# EAGLE design 3-Axis CNC Board v1.1 (EAGLE 6.5.0)
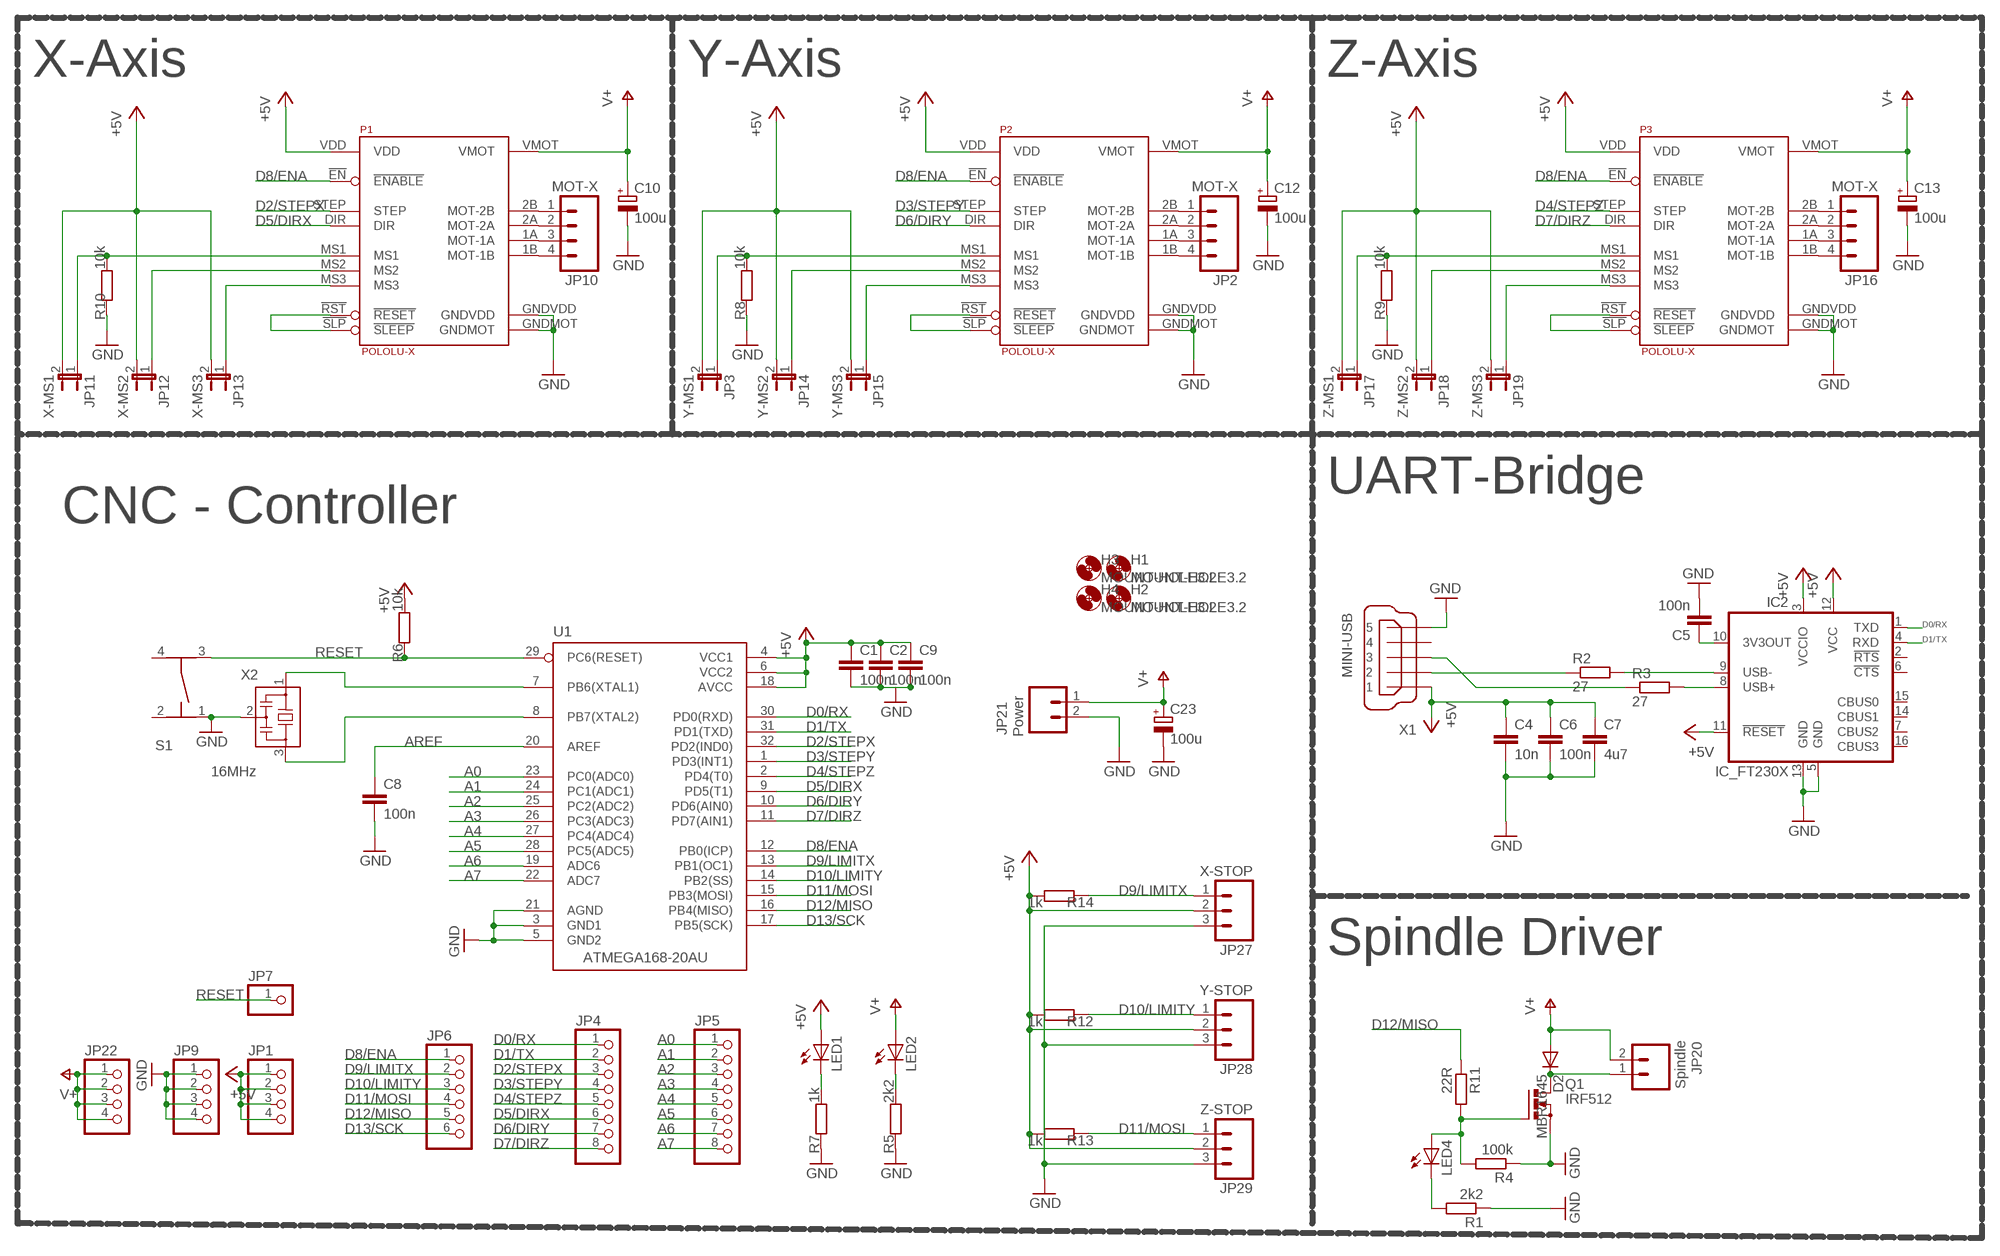
[diagram p0: schematic, sheet 1]

## Parts
C1  100n  C-EUC0805K  [C0805K]
C2  100n  C-EUC0805K  [C0805K]
C4  10n  C-EUC0805K  [C0805K]
C5  100n  C-EUC0805K  [C0805K]
C6  100n  C-EUC0805K  [C0805K]
C7  4u7  C-EUC0805K  [C0805K]
C8  100n  C-EUC0805K  [C0805K]
C9  100n  C-EUC0805K  [C0805K]
C10  100u  CPOL-EUUD-6,3X7,7  [UD-6,3X7,7_NICHICON]
C12  100u  CPOL-EUUD-6,3X7,7  [UD-6,3X7,7_NICHICON]
C13  100u  CPOL-EUUD-6,3X7,7  [UD-6,3X7,7_NICHICON]
C23  100u  CPOL-EUUD-6,3X7,7  [UD-6,3X7,7_NICHICON]
D2  MBR1645  BYT08P  [TO220ACS]
H1  MOUNT-HOLE3.2  [3,2]
H2  MOUNT-HOLE3.2  [3,2]
H3  MOUNT-HOLE3.2  [3,2]
H4  MOUNT-HOLE3.2  [3,2]
IC2  IC_FT230X  IC_FT230X-SSOP-16  [SSOP-16-FTDI]
JP1  PINHD-1X4_2.54  [1X04]
JP2  MOT-X  M04POLAR  [MOLEX-1X4]
JP3  Y-MS1  JUMPER-2PTH  [1X02]
JP4  PINHD-1X8_2.54  [1X08]
JP5  PINHD-1X8_2.54  [1X08]
JP6  PINHD-1X6_2.54  [1X06]
JP7  PINHD-1X1  [1X01]
JP9  PINHD-1X4_2.54  [1X04]
JP10  MOT-X  M04POLAR  [MOLEX-1X4]
JP11  X-MS1  JUMPER-2PTH  [1X02]
JP12  X-MS2  JUMPER-2PTH  [1X02]
JP13  X-MS3  JUMPER-2PTH  [1X02]
JP14  Y-MS2  JUMPER-2PTH  [1X02]
JP15  Y-MS3  JUMPER-2PTH  [1X02]
JP16  MOT-X  M04POLAR  [MOLEX-1X4]
JP17  Z-MS1  JUMPER-2PTH  [1X02]
JP18  Z-MS2  JUMPER-2PTH  [1X02]
JP19  Z-MS3  JUMPER-2PTH  [1X02]
JP20  Spindle  M025MM  [SCREWTERMINAL-5MM-2]
JP21  Power  M025MM  [SCREWTERMINAL-5MM-2]
JP22  PINHD-1X4_2.54  [1X04]
JP27  X-STOP  M03POLAR  [MOLEX-1X3]
JP28  Y-STOP  M03POLAR  [MOLEX-1X3]
JP29  Z-STOP  M03POLAR  [MOLEX-1X3]
LED1  LEDCHIPLED_1206  [CHIPLED_1206]
LED2  LEDCHIPLED_1206  [CHIPLED_1206]
LED4  LEDCHIPLED_1206  [CHIPLED_1206]
P1  POLOLU-X  POLOLU-ALLEGRO  [POLOLU-ALLEGRO-PTH]
P2  POLOLU-X  POLOLU-ALLEGRO  [POLOLU-ALLEGRO-PTH]
P3  POLOLU-X  POLOLU-ALLEGRO  [POLOLU-ALLEGRO-PTH]
Q1  IRF512  [TO220BV]
R1  2k2  R-EU_R1206  [R1206]
R2  27  R-EU_R1206  [R1206]
R3  27  R-EU_R1206  [R1206]
R4  100k  R-EU_R1206  [R1206]
R5  2k2  R-EU_R1206  [R1206]
R6  10k  R-EU_R1206  [R1206]
R7  1k  R-EU_R1206  [R1206]
R8  10k  R-EU_R1206  [R1206]
R9  10k  R-EU_R1206  [R1206]
R10  10k  R-EU_R1206  [R1206]
R11  22R  R-EU_R1206  [R1206]
R12  1k  R-EU_R1206  [R1206]
R13  1k  R-EU_R1206  [R1206]
R14  1k  R-EU_R1206  [R1206]
S1  TASTER-9314_SMD  [TASTER-9314_SMD]
U1  ATMEGA168-20AU  [QFP032]
X1  MINI-USB  MINI-USB-32005-021-NODRILL  [32005-201_1]
X2  16MHz  CSTCE_G8M00G52A  [CSTCE_]

## Nets
+5V: C1.1 C2.1 C4.1 C6.1 C7.1 C9.1 IC2.3(VCCIO) IC2.11(!RESET) IC2.12(VCC) JP1.1 JP1.2 JP1.3 JP1.4 JP3.2 JP11.2 JP12.2 JP13.2 JP14.2 JP15.2 JP17.2 JP18.2 JP19.2 JP27.2 JP28.2 JP29.2 LED1.A P1.VDD P2.VDD P3.VDD R6.2 R12.2 R13.2 R14.2 U1.4(VCC1) U1.6(VCC2) U1.18(AVCC) X1.1
A0: JP5.1 U1.23(PC0(ADC0))
A1: JP5.2 U1.24(PC1(ADC1))
A2: JP5.3 U1.25(PC2(ADC2))
A3: JP5.4 U1.26(PC3(ADC3))
A4: JP5.5 U1.27(PC4(ADC4))
A5: JP5.6 U1.28(PC5(ADC5))
A6: JP5.7 U1.19(ADC6)
A7: JP5.8 U1.22(ADC7)
AREF: C8.1 U1.20(AREF)
D0/RX: IC2.1(TXD) JP4.1 U1.30(PD0(RXD))
D1/TX: IC2.4(RXD) JP4.2 U1.31(PD1(TXD))
D2/STEPX: JP4.3 P1.STEP U1.32(PD2(IND0))
D3/STEPY: JP4.4 P2.STEP U1.1(PD3(INT1))
D4/STEPZ: JP4.5 P3.STEP U1.2(PD4(T0))
D5/DIRX: JP4.6 P1.DIR U1.9(PD5(T1))
D6/DIRY: JP4.7 P2.DIR U1.10(PD6(AIN0))
D7/DIRZ: JP4.8 P3.DIR U1.11(PD7(AIN1))
D8/ENA: JP6.1 P1.!EN(!ENABLE) P2.!EN(!ENABLE) P3.!EN(!ENABLE) U1.12(PB0(ICP))
D9/LIMITX: JP6.2 JP27.1 R14.1 U1.13(PB1(OC1))
D10/LIMITY: JP6.3 JP28.1 R12.1 U1.14(PB2(SS))
D11/MOSI: JP6.4 JP29.1 R13.1 U1.15(PB3(MOSI))
D12/MISO: JP6.5 R11.1 U1.16(PB4(MISO))
D13/SCK: JP6.6 U1.17(PB5(SCK))
D+: IC2.8(USB+) R3.2
D-: IC2.9(USB-) R2.2
GND: C1.2 C2.2 C4.2 C5.2 C6.2 C7.2 C8.2 C9.2 C10.- C12.- C13.- C23.- IC2.5(GND) IC2.13(GND) JP9.1 JP9.2 JP9.3 JP9.4 JP21.2 JP27.3 JP28.3 JP29.3 P1.GNDMOT P1.GNDVDD P2.GNDMOT P2.GNDVDD P3.GNDMOT P3.GNDVDD Q1.S R1.1 R4.1 R5.1 R7.1 R8.1 R9.1 R10.1 S1.1 U1.3(GND1) U1.5(GND2) U1.21(AGND) X1.5 X2.2
N$1: U1.8(PB7(XTAL2)) X2.3
N$2: U1.7(PB6(XTAL1)) X2.1
N$4: R3.1 X1.3
N$5: D2.C JP20.1 Q1.D
N$7: LED1.C R7.2
N$8: C5.1 IC2.10(3V3OUT)
N$9: R2.1 X1.2
N$10: LED4.C R1.2
N$17: LED2.C R5.2
N$64: LED4.A Q1.G R4.2 R11.2
RESET: JP7.1 R6.1 S1.3 U1.29(PC6(RESET))
V+: C10.+ C12.+ C13.+ C23.+ D2.A JP20.2 JP21.1 JP22.1 JP22.2 JP22.3 JP22.4 LED2.A P1.VMOT P2.VMOT P3.VMOT
X-MOT-1A [power]: JP10.3 P1.1A(MOT-1A)
X-MOT-1A1 [power]: JP2.3 P2.1A(MOT-1A)
X-MOT-1A2 [power]: JP16.3 P3.1A(MOT-1A)
X-MOT-1B [power]: JP10.4 P1.1B(MOT-1B)
X-MOT-1B1 [power]: JP2.4 P2.1B(MOT-1B)
X-MOT-1B2 [power]: JP16.4 P3.1B(MOT-1B)
X-MOT-2A [power]: JP10.2 P1.2A(MOT-2A)
X-MOT-2A1 [power]: JP2.2 P2.2A(MOT-2A)
X-MOT-2A2 [power]: JP16.2 P3.2A(MOT-2A)
X-MOT-2B [power]: JP10.1 P1.2B(MOT-2B)
X-MOT-2B1 [power]: JP2.1 P2.2B(MOT-2B)
X-MOT-2B2 [power]: JP16.1 P3.2B(MOT-2B)
X-MS1: JP11.1 P1.MS1 R10.2
X-MS2: JP12.1 P1.MS2
X-MS3: JP13.1 P1.MS3
X-MS4: JP14.1 P2.MS2
X-MS5: JP15.1 P2.MS3
X-MS6: JP3.1 P2.MS1 R8.2
X-MS7: JP18.1 P3.MS2
X-MS8: JP19.1 P3.MS3
X-MS9: JP17.1 P3.MS1 R9.2
X-RESETSLEEP: P1.!RST(!RESET) P1.!SLP(!SLEEP)
X-RESETSLEEP1: P2.!RST(!RESET) P2.!SLP(!SLEEP)
X-RESETSLEEP2: P3.!RST(!RESET) P3.!SLP(!SLEEP)
Unconnected: IC2.2(!RTS) IC2.6(!CTS) IC2.7(CBUS2) IC2.14(CBUS1) IC2.15(CBUS0) IC2.16(CBUS3) S1.2 S1.4 X1.4

## Notes on the sheet
- X-Axis | Y-Axis | Z-Axis
- UART-Bridge
- CNC - Controller
- Spindle Driver

## Library data of the parts
C1 C2 C4-C9 = rcl:C-EU: CAPACITOR, European symbol
C10 C12 C13 C23 = rcl:CPOL-EU: POLARIZED CAPACITOR, European symbol
D2 = diode:BYT08P: DIODE ultra fast
H1-H4 = holes:MOUNT-HOLE: MOUNTING HOLE with drill center marker
IC2 = dp_devices:IC_FT230X: BASIC USB to UART IC
JP1 JP9 JP22 = pinhead-1:PINHD-1X4: PIN HEADER
JP2 JP10 JP16 = SparkFun:M04: Header 4 Standard 4-pin 0.1" header. Use with straight break away headers (SKU : PRT-00116), right angle break away headers (PRT-00553), swiss pins (PRT-00743), machine pins (PRT-00117), and female headers (PRT-00115). Molex polarized connector foot print use with SKU : PRT-08231 with associated crimp pins and housings.
JP3 JP11-JP15 JP17-JP19 = SparkFun:JUMPER-2: Jumper Basic 0.1" spaced jumper. Use with breakaway headers.
JP4 JP5 = pinhead-1:PINHD-1X8: PIN HEADER
JP6 = pinhead-1:PINHD-1X6: PIN HEADER
JP7 = pinhead:PINHD-1X1: PIN HEADER
JP20 JP21 = SparkFun-Connectors:M02: Standard 2-pin 0.1" header. Use with - straight break away headers ( PRT-00116) - right angle break away headers (PRT-00553) - swiss pins (PRT-00743) - machine pins (PRT-00117) - female headers (PRT-00115) Molex polarized connector foot print use with: PRT-08233 with associated crimp pins and housings. 2.54_SCREWTERM for use with PRT-10571. 3.5mm Screw Terminal footprints for PRT-08084 5mm Screw Terminal footprints for use with PRT-08433
JP27-JP29 = SparkFun:M03: Header 3 Standard 3-pin 0.1" header. Use with straight break away headers (SKU : PRT-00116), right angle break away headers (PRT-00553), swiss pins (PRT-00743), machine pins (PRT-00117), and female headers (PRT-00115). Molex polarized connector foot print use with SKU : PRT-08232 with associated crimp pins and housings.
LED1 LED2 LED4 = led:LED: LED OSRAM: - CHIPLED LG R971, LG N971, LY N971, LG Q971, LY Q971, LO R971, LY R971 LH N974, LH R974 LS Q976, LO Q976, LY Q976 LO Q996 - Hyper CHIPLED LW Q18S LB Q993, LB Q99A, LB R99A - SideLED LS A670, LO A670, LY A670, LG A670, LP A670 LB A673, LV A673, LT A673, LW A673 LH A674 LY A675 LS A676, LA A676, LO A676, LY A676, LW A676 LS A679, LY A679, LG A679 - Hyper Micro SIDELED® LS Y876, LA Y876, LO Y876, LY Y876 LT Y87S - SmartLED LW L88C, LW L88S LB L89C, LB L89S, LG L890 LS L89K, LO L89K, LY L89K LS L896, LA L896, LO L896, LY L896 - TOPLED LS T670, LO T670, LY T670, LG T670, LP T670 LSG T670, LSP T670, LSY T670, LOP T670, LYG T670 LG T671, LOG T671, LSG T671 LB T673, LV T673, LT T673, LW T673 LH T674 LS T676, LA T676, LO T676, LY T676, LB T676, LH T676, LSB T676, LW T676 LB T67C, LV T67C, LT T67C, LS T67K, LO T67K, LY T67K, LW E67C LS E67B, LA E67B, LO E67B, LY E67B, LB E67C, LV E67C, LT E67C LW T67C LS T679, LY T679, LG T679 LS T770, LO T770, LY T770, LG T770, LP T770 LB T773, LV T773, LT T773, LW T773 LH T774 LS E675, LA E675, LY E675, LS T675 LS T776, LA T776, LO T776, LY T776, LB T776 LHGB T686 LT T68C, LB T68C - Hyper Mini TOPLED® LB M676 - Mini TOPLED Santana® LG M470 LS M47K, LO M47K, LY M47K Source: http://www.osram.convergy.de LUXEON: - LUMILED® LXK2-PW12-R00, LXK2-PW12-S00, LXK2-PW14-U00, LXK2-PW14-V00 LXK2-PM12-R00, LXK2-PM12-S00, LXK2-PM14-U00 LXK2-PE12-Q00, LXK2-PE12-R00, LXK2-PE12-S00, LXK2-PE14-T00, LXK2-PE14-U00 LXK2-PB12-K00, LXK2-PB12-L00, LXK2-PB12-M00, LXK2-PB14-N00, LXK2-PB14-P00, LXK2-PB14-Q00 LXK2-PR12-L00, LXK2-PR12-M00, LXK2-PR14-Q00, LXK2-PR14-R00 LXK2-PD12-Q00, LXK2-PD12-R00, LXK2-PD12-S00 LXK2-PH12-R00, LXK2-PH12-S00 LXK2-PL12-P00, LXK2-PL12-Q00, LXK2-PL12-R00 Source: www.luxeon.com KINGBRIGHT: KA-3528ASYC Source: www.kingbright.com
P1-P3 = pololu-allegro:POLOLU-ALLEGRO
Q1 = transistor-power:IRF512: N-CHANNEL MOS FET
R1-R14 = rcl:R-EU_: RESISTOR, European symbol
S1 = SMD-taster:TASTER-9314_SMD
U1 = MySMD:ATMEGA168-20AU
X1 = con-cypressindustries:MINI-USB-: MINI USB-B Conector Source: www.cypressindustries.com
X2 = DragonLib:CSTCE_G: Resonator Source: murata.co.jp; MPN: CSTCE8M00G52-R0; OC_RS: 721-4827

## Board
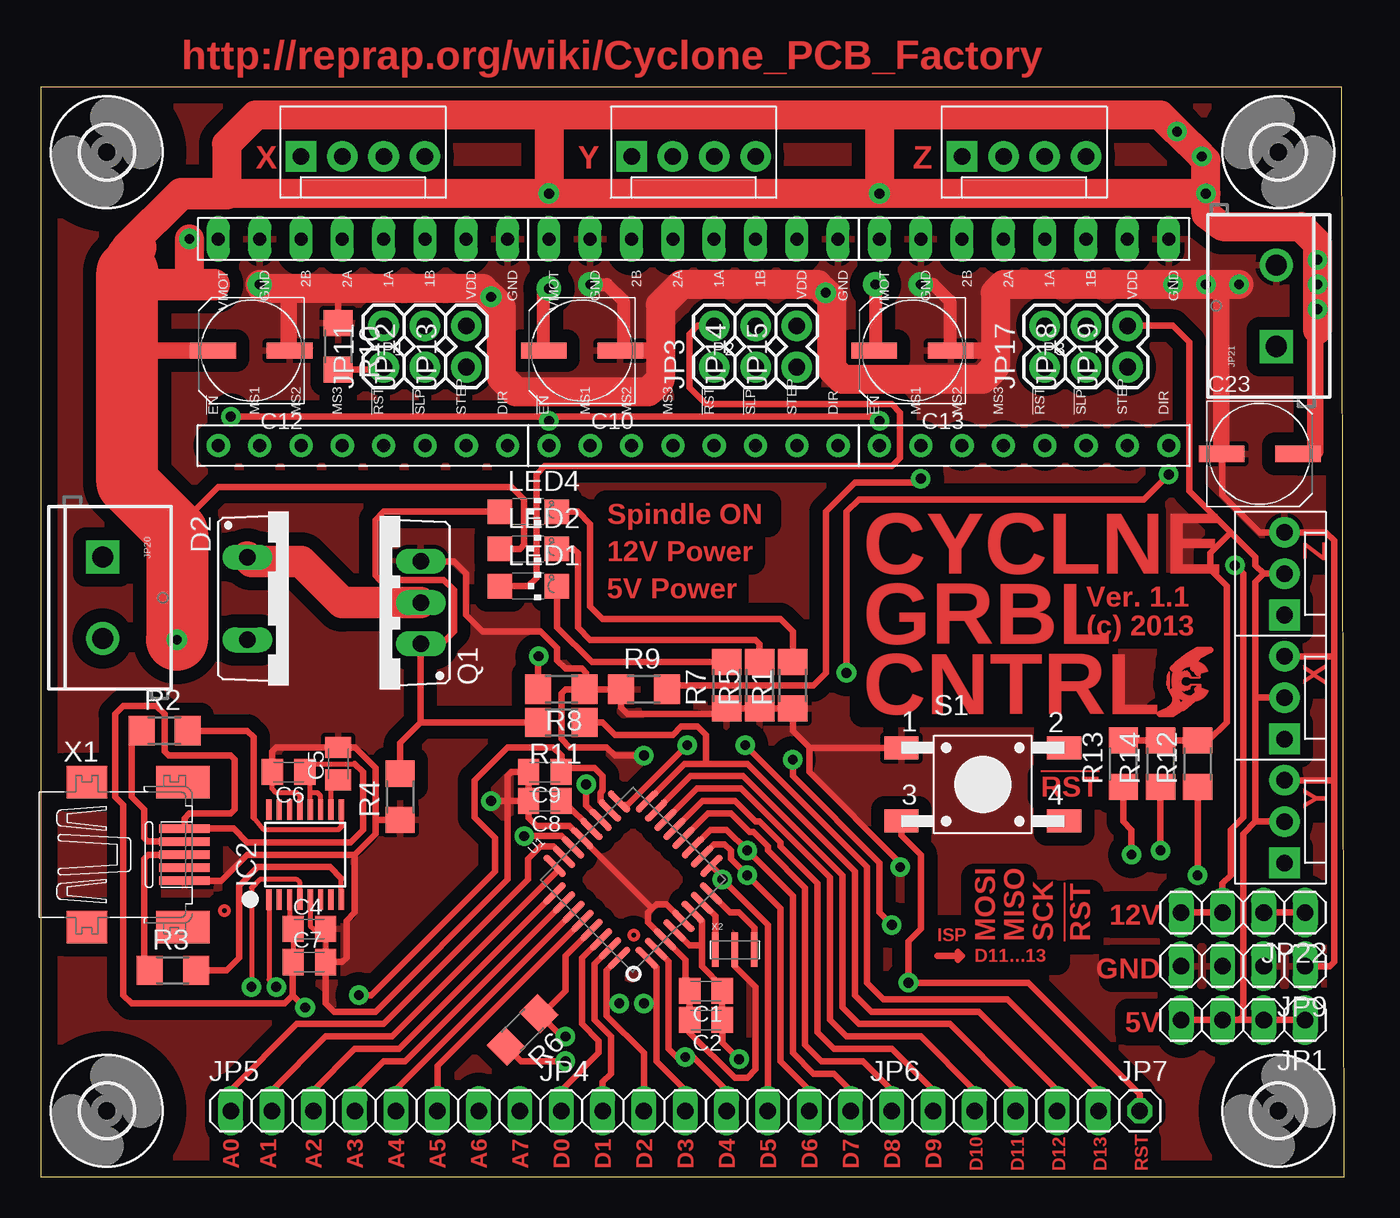
[diagram p1: board, top side]
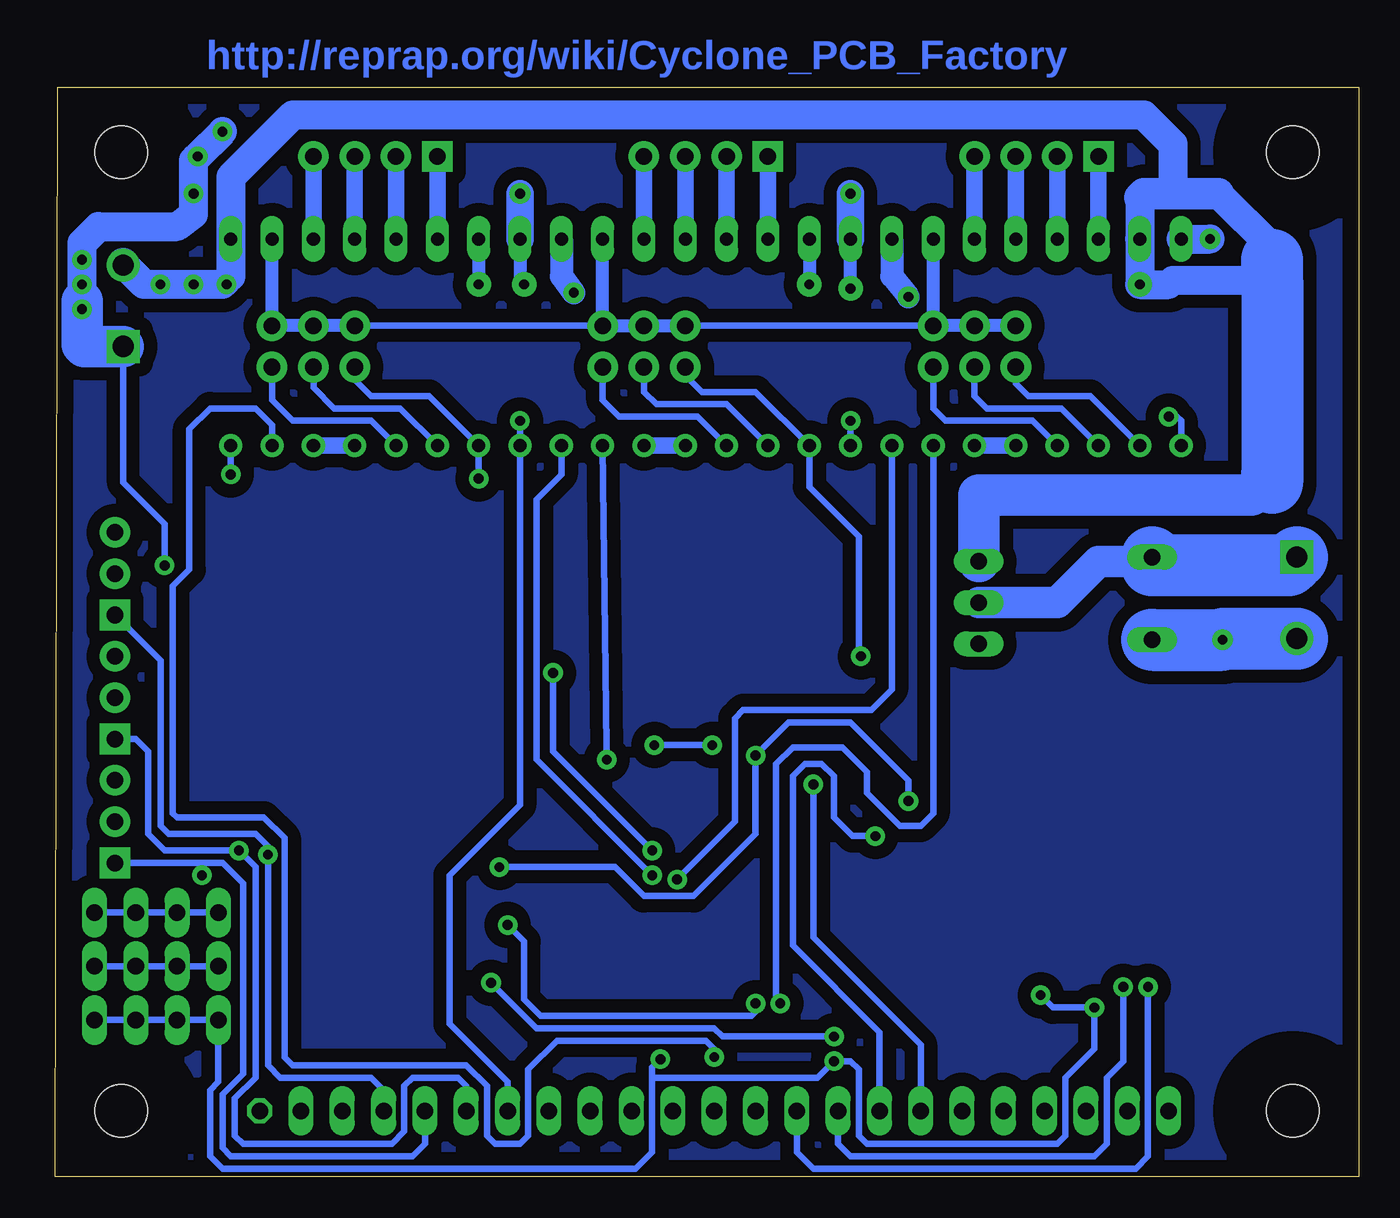
[diagram p2: board, bottom side, seen from below]

Size 80.12 x 66.98 mm. Coordinates in mm from the lower left corner, seen from the top.
Outline: 0,0 80.12,0 79.99,66.98 0,66.98 0,0
Copper layers (1*16): Top 0.035mm / dielectric 1.5mm / Bottom 0.035mm
Design rules "default *": minimum track width 10mil, minimum drill 24mil, track to track 2mil, track to pad 2mil, pad to pad 2mil, via to via 2mil, smd to smd 2mil, copper to edge 40mil, drill to drill 2mil, minimum pad ring 10mil, minimum via ring 8mil, stop-mask expansion 4mil, vias tented up to drill 0mil, thermal gap 10mil

### Footprints (pad centres in the part's own frame; a part is rotated, then mirrored left to right if it is on the bottom)
C0805K = smd 1.3 x 1.6: 1 -1,0; 2 1,0
UD-6,3X7,7_NICHICON = smd 2.8 x 1: + 2.35,0; - -2.35,0
TO220ACS = drill 1.016 long: A 2.54,-2.54; C -2.54,-2.54
3,2 = hole 3.2: 0,0
SSOP-16-FTDI = smd 0.32 x 1.26: 1 -2.223,-2.779; 2 -1.588,-2.779; 3 -0.953,-2.779; 4 -0.318,-2.779; 5 0.317,-2.779; 6 0.952,-2.779; 7 1.587,-2.779; 8 2.222,-2.779; 9 2.222,2.779; 10 1.587,2.779; 11 0.952,2.779; 12 0.317,2.779; 13 -0.318,2.779; 14 -0.953,2.779; 15 -1.588,2.779; 16 -2.223,2.779
1X04 = drill 1.016 long: 1 -3.81,0; 2 -1.27,0; 3 1.27,0; 4 3.81,0
MOLEX-1X4 = drill 1.016 pad 1.88 square: 1 0,0 | drill 1.016 pad 1.88: 2 2.54,0; 3 5.08,0; 4 7.62,0
1X02 = drill 1.016 pad 1.88: 1 0,0; 2 2.54,0
1X08 = drill 1.016 long: 1 -8.89,0; 2 -6.35,0; 3 -3.81,0; 4 -1.27,0; 5 1.27,0; 6 3.81,0; 7 6.35,0; 8 8.89,0
1X06 = drill 1.016 long: 1 -6.35,0; 2 -3.81,0; 3 -1.27,0; 4 1.27,0; 5 3.81,0; 6 6.35,0
1X01 = drill 1.016 octagon: 1 0,0
SCREWTERMINAL-5MM-2 = drill 1.3 pad 2.032 square: 1 0,0 | drill 1.3 pad 2.032: 2 5,0
MOLEX-1X3 = drill 1.016 pad 1.88 square: 1 0,0 | drill 1.016 pad 1.88: 2 2.54,0; 3 5.08,0
CHIPLED_1206 = smd 1.5 x 1.5: A 0,-1.75; C 0,1.75
POLOLU-ALLEGRO-PTH = drill 0.8 pad 1.422 long: 1A 6.35,-1.27; 1B 6.35,-3.81; 2A 6.35,1.27; 2B 6.35,3.81; GNDMOT 6.35,6.35; GNDVDD 6.35,-8.89; VDD 6.35,-6.35; VMOT 6.35,8.89 | drill 0.8 pad 1.422: !EN -6.35,8.89; !RST -6.35,-1.27; !SLP -6.35,-3.81; DIR -6.35,-8.89; MS1 -6.35,6.35; MS2 -6.35,3.81; MS3 -6.35,1.27; STEP -6.35,-6.35
TO220BV = drill 1.016 long: D 0,-2.54; G -2.54,-2.54; S 2.54,-2.54
R1206 = smd 1.6 x 1.803: 1 -1.422,0; 2 1.422,0
TASTER-9314_SMD = smd 2.1 x 1.4: 1 -5,2.25; 2 5,2.25; 3 -5,-2.25; 4 5,-2.25
QFP032 = smd 0.432 x 1.778: 1 0,0; 2 0.8,0; 3 1.599,0; 4 2.399,0; 5 3.199,0; 6 3.998,0; 7 4.798,0; 8 5.598,0; 17 5.588,8.001; 18 4.798,7.997; 19 3.998,7.997; 20 3.199,7.997; 21 2.399,7.997; 22 1.599,7.997; 23 0.799,7.997; 24 0,7.997 | smd 1.778 x 0.432: 9 6.807,1.194; 10 6.807,2.007; 11 6.807,2.794; 12 6.807,3.607; 13 6.807,4.394; 14 6.807,5.182; 15 6.807,5.994; 16 6.816,6.803; 25 -1.194,6.807; 26 -1.194,5.994; 27 -1.194,5.182; 28 -1.194,4.394; 29 -1.194,3.607; 30 -1.194,2.794; 31 -1.194,2.007; 32 -1.194,1.194
32005-201_1 = smd 3.1 x 0.5: 1 3,1.6; 2 3,0.8; 3 3,0; 4 3,-0.8; 5 3,-1.6 | smd 2.5 x 2: M1 -3,-4.45; M2 -3,4.45 | smd 3.3 x 2: M3 2.9,4.45; M4 2.9,-4.45
CSTCE_ = smd 0.4 x 2.1: 1 -1.2,0; 2 0,0; 3 1.2,0

### Placement (x,y rotation side)
C1  40.89,11.43 180 top
C2  40.89,9.65 180 top
C4  16.51,15.24 0 top
C5  18.29,25.4 90 top
C6  15.24,24.89 180 top
C7  16.51,13.21 0 top
C8  30.99,23.11 180 top
C9  30.99,24.89 180 top
C10  33.27,50.8 180 top
C12  12.95,50.8 180 top
C13  53.59,50.8 180 top
C23  74.93,44.45 0 top
D2  15.24,35.56 270 top
H1  76.07,62.99 90 top
H2  4.06,62.99 0 top
H3  76.07,4.06 0 top
H4  4.06,4.06 0 top
IC2  16.26,19.81 0 top
JP1  73.91,9.65 180 top
JP2  36.32,62.74 0 top
JP3  41.4,49.78 90 top
JP4  40.89,4.06 0 top
JP5  20.57,4.06 0 top
JP6  58.67,4.06 0 top
JP7  67.56,4.06 0 top
JP9  73.91,12.95 180 top
JP10  16,62.74 0 top
JP11  21.08,49.78 90 top
JP12  23.62,49.78 90 top
JP13  26.16,49.78 90 top
JP14  43.94,49.78 90 top
JP15  46.48,49.78 90 top
JP16  56.64,62.74 0 top
JP17  61.72,49.78 90 top
JP18  64.26,49.78 90 top
JP19  66.8,49.78 90 top
JP20  3.81,38.1 270 top
JP21  75.95,51.05 90 top
JP22  73.91,16.26 180 top
JP27  76.45,26.92 90 top
JP28  76.45,19.3 90 top
JP29  76.45,34.54 90 top
LED1  29.97,36.32 270 top
LED2  29.97,38.61 270 top
LED4  29.97,40.89 270 top
P1  19.81,51.31 90 top
P2  40.13,51.31 90 top
P3  60.45,51.31 90 top
Q1  20.83,35.31 90 top
R1  46.23,30.23 90 top
R2  7.62,27.43 0 top
R3  8.13,12.7 0 top
R4  22.1,23.37 90 top
R5  44.2,30.23 90 top
R6  29.61,9.04 225 top
R7  42.16,30.23 90 top
R8  32,29.97 180 top
R9  37.08,29.97 0 top
R10  18.29,51.05 270 top
R11  32,27.94 180 top
R12  71.12,25.4 90 top
R13  66.55,25.4 90 top
R14  68.83,25.4 90 top
S1  57.91,24.13 0 top
U1  37.25,13.47 45 top
X1  5.84,19.81 0 top
X2  42.67,13.97 0 top

### Tracks (layer width: path | path; a pad name or v marks a point on that pad's centre or on a via)
+5V  (via drill 0.6 pad 1.2)
  Top 0.305: IC2.3 15.3,15.45 C4.1 C7.1 | IC2.12 16.57,23.62 | 16.57,23.62 16.57,24.56 C6.1 16.24,25.13 16.51,25.4 19.3,25.4 | IC2.11 17.21,23.43 17.02,23.62 16.57,23.62
  Top 0.406: U1.6 40.64,15.73 40.64,14.22 | U1.4 39.89,14.22 40.64,14.22 | 40.64,14.22 40.64,12.95 41.89,11.7 C1.1 C2.1 41.91,9.64 41.91,8.26 v42.93,7.24 | U1.18 34.42,23.09 34.42,23.62 34.54,23.75 34.54,24.64 34.04,25.15 32.51,25.15 32.26,24.89 C9.1 32,24.91 32,25.91 31.5,26.42 28.7,26.42 26.67,24.38 26.67,22.1 27.94,20.83 27.94,18.8 20.32,11.18 v19.56,11.18 | R6.2 29.53,7.11 v32.26,7.11 | 19.3,25.4 19.81,24.89 19.81,21.34 19.05,20.57 12.7,20.57 11.86,21.41 X1.1 8.84,22.05 9.14,22.35 11.68,22.35 11.94,22.61 11.94,25.65 11.68,25.91 7.87,25.91 7.62,26.16 7.62,28.45 7.11,28.96 5.08,28.96 4.57,28.45 4.57,23.37 5.08,22.86 5.08,11.18 5.59,10.67 14.99,10.67 15.49,11.18 | 15.49,11.18 15.49,13.19 C7.1 | 15.49,11.18 v16.26,10.41 | JP1.3 73.66,9.65 73.91,9.91 73.91,21.08 74.68,21.84 | JP3.2 40.39,52.32 39.88,51.82 39.88,48.51 40.89,47.5 52.32,47.5 52.83,46.99 52.83,44.2 52.32,43.69 30.99,43.69 30.48,43.18 30.48,36.83 29.97,36.32 LED1.A | JP19.2 69.6,52.32 70.61,51.31 70.61,42.16 73.15,39.62 | JP28.2 74.68,21.84 | 74.68,21.84 74.68,29.46 | 74.68,29.46 74.68,36.58 75.18,37.08 | 75.18,37.08 JP29.2 | JP27.2 74.68,29.46 | 75.18,37.08 74.68,37.59 74.68,38.1 73.15,39.62 | R14.2 R13.2 R12.2 71.78,26.82 72.9,27.94 72.9,36.32 71.88,37.34 71.88,38.35 73.15,39.62 | JP1.4 JP1.1
  Bottom 0.406: v19.56,11.18 18.8,10.41 v16.26,10.41 16.26,7.87 18.03,6.1 18.03,2.54 18.54,2.03 30.23,2.03 30.73,2.54 30.73,6.6 31.24,7.11 v32.26,7.11 33.27,6.1 43.43,6.1 | v42.93,7.24 43.43,6.73 43.43,6.1 | 43.43,6.1 43.43,1.52 44.45,0.51 69.85,0.51 70.61,1.27 70.61,5.33 70.1,5.84 JP1.4 JP1.3 JP1.2 JP1.1 | JP13.2 JP3.2 | JP15.2 JP17.2
  Bottom 0.813: JP17.2 JP18.2 JP19.2 P3.VDD | JP3.2 JP14.2 JP15.2 P2.VDD | JP11.2 JP12.2 JP13.2 P1.VDD
A0
  Top 0.406: JP5.1 11.68,5.33 15.75,9.4 21.08,9.4 29.97,18.29 29.97,19.56 30.73,20.32 31.53,20.32 U1.23
A1
  Top 0.406: U1.24 31.75,18.97 31.75,18.8 21.59,8.64 17.53,8.64 14.22,5.33 JP5.2
A2
  Top 0.406: U1.25 22.03,7.87 19.3,7.87 16.76,5.33 JP5.3
A3
  Top 0.406: U1.26 22.42,7.11 21.08,7.11 19.3,5.33 JP5.4
A4
  Top 0.406: U1.27 21.84,5.39 JP5.5
A5
  Top 0.406: U1.28 24.38,6.82 JP5.6
A6  (via drill 0.6 pad 1.2)
  Top 0.406: U1.19 33.53,22.85 v33.53,24.13
  Bottom 0.406: v33.53,24.13 33.53,14.73 26.92,8.13 JP5.7
A7  (via drill 0.6 pad 1.2)
  Top 0.406: U1.22 32.03,20.95 v29.72,20.95
  Bottom 0.406: v29.72,20.95 31.11,20.95 32.26,22.1 32.26,24.64 33.02,25.4 34.04,25.4 34.8,24.64 34.8,14.22 29.46,8.89 JP5.8
AREF
  Top 0.406: U1.20 32.24,23 C8.1
D0/RX  (via drill 0.6 pad 1.2)
  Top 0.305: IC2.1 14.03,12.13 v14.48,11.68
  Top 0.406: JP4.1 32,5.33 34.29,7.62 34.29,8.38 33.27,9.4 33.27,13.46 34.41,14.6 U1.30
  Bottom 0.406: v14.48,11.68 14.48,7.11 15.49,6.1 15.49,2.03 16.26,1.27 31.24,1.27 32,2.03 JP4.1
D1/TX  (via drill 0.6 pad 1.2)
  Top 0.305: IC2.4 15.94,18.1 15.75,18.29 13.46,18.29 12.95,17.78 v12.95,11.68
  Top 0.406: U1.31 34.04,13.09 34.04,9.65 35.05,8.64 35.05,6.35 34.54,5.84 JP4.2
  Bottom 0.406: v12.95,11.68 12.95,1.27 13.72,0.51 33.53,0.51 34.54,1.52 JP4.2
D2/STEPX  (via drill 0.6 pad 1.2)
  Top 0.406: U1.32 34.8,12.71 34.8,10.67 | 34.8,10.67 34.8,9.91 37.08,7.62 JP4.3 | v35.56,10.67 34.8,10.67
  Bottom 0.406: P1.STEP 26.16,22.35 26.92,21.59 28.19,21.59 30.23,23.62 30.23,24.89 31.75,26.42 34.8,26.42 35.81,25.4 35.81,10.92 v35.56,10.67
D3/STEPY  (via drill 0.6 pad 1.2)
  Top 0.406: JP4.4 39.62,5.33 37.85,7.11 37.85,10.67 | 37.85,10.67 37.85,12.87 U1.1 | 37.85,10.67 v37.08,10.67 | v52.32,15.49 51.56,16.26 51.56,19.3 46.23,24.64 v46.23,25.65
  Bottom 0.406: P2.STEP 46.23,26.42 v46.23,25.65 | v37.08,10.67 37.08,10.16 37.34,9.91 50.29,9.91 51.31,10.92 51.31,14.48 v52.32,15.49
D4/STEPZ  (via drill 0.6 pad 1.2)
  Top 0.406: JP4.5 42.16,5.33 40.13,7.37 v39.62,7.37 39.12,7.37 38.61,7.87 38.61,13.24 U1.2
  Bottom 0.406: v39.62,7.37 39.62,7.87 40.13,8.38 49.28,8.38 51.05,6.6 51.05,2.54 51.56,2.03 53.09,2.03 53.59,2.54 53.59,5.59 54.86,6.86 65.53,6.86 66.04,7.37 66.04,20.83 67.31,22.1 72.64,22.1 72.9,22.35 72.9,36.32 71.88,37.34 71.88,45.97 70.61,47.24 67.82,47.24 66.8,46.23 P3.STEP
D5/DIRX  (via drill 0.6 pad 1.2)
  Top 0.406: U1.9 41.91,18.44 v41.91,18.29 44.7,15.49 JP4.6
  Bottom 0.406: P1.DIR 28.7,29.97 29.97,28.7 37.85,28.7 38.35,28.19 38.35,21.84 v41.91,18.29
D6/DIRY  (via drill 0.6 pad 1.2)
  Top 0.406: JP4.7 47.24,5.33 45.47,7.11 45.47,16.51 v43.43,18.54 42.42,19.56 42.42,20.07 42.04,20.45 41.39,20.45 U1.10
  Bottom 0.406: v43.43,18.54 50.55,25.65 50.55,41.66 49.02,43.18 P2.DIR
D7/DIRZ  (via drill 0.6 pad 1.2)
  Top 0.406: JP4.8 49.78,5.33 48.77,6.35 47.5,6.35 46.23,7.62 46.23,17.27 v43.43,20.07 42.16,21.34 41.17,21.34 U1.11 | v49.53,30.99 49.53,40.89 50.29,41.66 67.82,41.66 v69.34,43.18
  Bottom 0.406: v43.43,20.07 49.53,26.16 v49.53,30.99 | P3.DIR v69.34,43.18
D8/ENA  (via drill 0.6 pad 1.2)
  Top 0.406: v11.68,46.74 31.24,46.74 | 31.24,46.74 51.31,46.74 v51.56,46.48 | JP6.1 52.32,5.33 50.55,7.11 48.01,7.11 46.99,8.13 46.99,17.78 44.7,20.07 44.7,20.32 43.81,21.21 43.56,21.21 42.42,22.35 41.03,22.35 U1.12 | 31.24,46.74 v31.24,46.48
  Bottom 0.406: JP6.1 52.32,5.84 55.88,9.4 55.88,18.54 51.56,22.86 P3.!EN v51.56,46.48 | v11.68,46.74 11.18,46.74 10.92,46.48 P1.!EN | v31.24,46.48 P2.!EN
D9/LIMITX  (via drill 0.6 pad 1.2)
  Top 0.406: JP6.2 54.86,5.33 52.32,7.87 48.77,7.87 47.75,8.89 47.75,18.03 45.47,20.32 45.47,20.57 44.2,21.84 43.94,21.84 42.67,23.11 40.68,23.11 U1.13 | R14.1 v68.83,20.07
  Bottom 0.406: JP27.1 75.18,26.92 74.42,26.16 74.42,21.08 73.41,20.07 v68.83,20.07 67.82,19.05 67.82,6.1 69.09,4.83 69.09,2.54 68.58,2.03 59.44,2.03 58.67,2.79 58.67,5.59 58.17,6.1 55.37,6.1 54.86,5.59 JP6.2
D10/LIMITY  (via drill 0.6 pad 1.2)
  Top 0.406: JP6.3 57.4,5.33 54.1,8.64 49.53,8.64 48.51,9.65 48.51,18.41 43.05,23.88 40.33,23.88 U1.14 | R12.1 v71.12,18.54
  Bottom 0.406: JP28.1 71.12,19.3 | 71.12,19.3 69.85,19.3 68.58,18.03 68.58,6.35 69.85,5.08 69.85,1.78 69.34,1.27 58.17,1.27 57.4,2.03 JP6.3 | v71.12,18.54 71.12,19.3
D11/MOSI  (via drill 0.6 pad 1.2)
  Top 0.406: JP6.4 59.94,5.33 55.88,9.4 50.29,9.4 49.28,10.41 49.28,18.54 43.18,24.64 39.94,24.64 U1.15 | v67.06,19.81 67.06,21.34 66.55,21.84 R13.1
  Bottom 0.406: JP29.1 73.66,31.75 73.66,21.59 73.15,21.08 67.82,21.08 67.06,20.32 v67.06,19.81 67.06,6.86 66.29,6.1 60.71,6.1 59.94,5.33 JP6.4
D12/MISO
  Top 0.406: JP6.5 62.48,5.33 57.66,10.16 51.05,10.16 50.04,11.18 50.04,18.8 43.43,25.4 40.89,25.4 | 40.89,25.4 39.56,25.4 U1.16 | 40.89,25.4 40.89,27.18 40.39,27.69 39.37,27.69 38.86,27.18 35.31,27.18 34.54,27.94 R11.1
D13/SCK  (via drill 0.6 pad 1.2)
  Top 0.406: JP6.6 65.02,5.33 59.44,10.92 51.82,10.92 50.8,11.94 50.8,19.05 v43.31,26.54 | v39.75,26.54 36.07,22.86 35.76,22.86 U1.17
  Bottom 0.406: v39.75,26.54 v43.31,26.54
D+
  Top 0.305: IC2.8 18.48,18.35 18.29,18.54
  Top 0.406: R3.2 11.43,12.7 12.19,13.46 12.19,17.91 13.34,19.05 17.78,19.05 18.48,18.35
D-
  Top 0.305: IC2.9 18.48,21.53 18.29,21.34 13.72,21.34 13.08,22.1
  Top 0.406: 13.08,22.1 13.08,27.05 12.7,27.43 R2.2
GND  (via drill 0.6 pad 1.2, 0.6 pad 1.27, 0.6 pad 1.5)
  Top 0.305: IC2.5 16.57,15.43 16.76,15.24 C4.2 C7.2 | IC2.13 15.94,23.43 15.75,23.62 14.48,23.62 14.22,23.88 14.22,24.88 C6.2
  Top 0.406: U1.5 38.48,16.76 37.85,16.76 37.59,16.51 | 37.59,16.51 37.34,16.26 37.34,15.64 U1.3 39.62,13.36 39.62,11.94 39.89,11.67 C1.2 C2.2 39.89,8.87 42.67,6.1 43.43,6.1 43.94,6.6 43.94,11.68 42.67,12.95 X2.2 | 37.59,16.51 37.59,16.52 U1.21 32.52,21.59 30.48,21.59 29.99,22.08 C8.2 C9.2 28.96,24.89 28.7,24.64 28.7,23.11 | 20.57,21.84 20.57,25.15 19.32,26.4 C5.2 14.46,26.4 14.22,26.16 14.22,24.91 C6.2 | 20.57,21.84 20.57,21.08 19.3,19.81 | 19.3,19.81 12.7,19.81 11.1,18.21 X1.5 | 19.3,19.81 19.3,16.26 18.8,15.75 18.8,13.46 18.54,13.21 C7.2 17.51,10.68 18.03,10.16 20.57,10.16 28.7,18.29 28.7,23.11 | 28.7,23.11 29.97,23.11 | v27.69,23.11 28.7,23.11 | C23.- 72.64,44.39 72.64,41.91 74.93,39.62 JP29.3 78.99,39.62 79.5,39.12 79.5,32 | 79.5,32 79.5,24.38 | 79.5,24.38 79.5,13.21 79.25,12.95 JP9.1 | R5.1 R7.1 | R7.1 R1.1 46.23,27.43 47.24,26.42 | v37.08,25.91 35.31,25.91 34.8,26.42 32.51,26.42 32,26.92 32,29.72 32.26,29.97 R8.1 | R8.1 R9.1 35.66,28.85 36.07,28.45 41.81,28.45 R7.1 | R10.1 18.29,54.61 | Q1.S 25.4,37.85 26.16,37.08 26.16,34.54 27.18,33.53 30.73,33.53 31.75,32.51 31.75,31.75 32.26,31.24 33.27,31.24 33.53,30.99 33.53,30.07 R8.1 | JP28.3 79.5,24.38 | JP27.3 79.5,32 | S1.1 47.28,26.38 47.24,26.42 | v52.83,19.05 52.83,19.3 47.24,24.89 47.24,26.42 | R4.1 20.68,21.95 20.57,21.84
  Top 0.813: v54.1,54.86 54.86,54.86 55.88,53.85 55.88,50.86 C13.- | v13.46,54.86 14.22,54.86 | 15.24,50.86 C12.- | v33.78,54.86 34.8,54.86 35.81,53.85 35.81,50.99 C10.-
  Top 1.016: C23.- 72.58,54.8 72.64,54.86 | 15.24,50.86 15.24,54.61 | C10.- 38.1,50.8 | C13.- 58.67,50.8
  Top 1.778: v73.66,54.86 72.64,54.86 v71.63,54.86 v69.6,54.86 59.18,54.86 58.67,54.36 58.67,50.8 58.67,49.78 57.91,49.02 49.28,49.02 48.64,49.66 48.64,53.98 v48.26,54.36 47.75,54.86 39.37,54.86 38.1,53.59 38.1,50.8 38.1,49.02 37.34,48.26 29.21,48.26 28.32,49.15 28.32,53.47 v27.69,54.1 27.18,54.61 18.29,54.61 15.24,54.61 13.72,54.61 v13.46,54.86
  Bottom 0.406: v27.69,23.11 27.69,24.38 31.24,27.94 35.05,27.94 v37.08,25.91 37.08,21.08 40.89,17.27 43.94,17.27 45.72,19.05 v52.83,19.05 | JP9.1 JP9.2 JP9.3 JP9.4
  Bottom 0.813: P3.GNDMOT v54.1,54.86 | P2.GNDMOT v33.78,54.86
  Bottom 1.422: P2.GNDVDD 49.02,55.37 v48.26,54.36 | P1.GNDVDD 28.7,55.37 v27.69,54.1
  Bottom 1.778: 13.46,60.2 P1.GNDMOT v13.46,54.86 11.68,54.86 11.43,55.12 5.33,55.12 | 75.95,56.13 74.68,54.86 v73.66,54.86 v71.63,54.86 69.85,54.86 69.34,55.37 P3.GNDVDD 69.34,61.47 65.53,65.28 13.21,65.28 11.43,63.5 11.43,60.45 | 8.64,60.45 5.33,57.15
  Bottom 1.93: 13.46,60.2 13.21,60.45 11.43,60.45 8.64,60.45 | JP21.2 75.95,56.13
  Bottom 2.54: 5.33,43.18 6.6,41.91 23.37,41.91 Q1.S
  Bottom 3.81: 5.33,42.67 5.33,43.18 5.33,55.12 5.33,56.39
  pour Top (isolate 0.813): 0,0 80.01,0 80.01,67.06 0,67.06
N$1
  Top 0.406: X2.3 43.87,15.31 42.93,16.26 42.38,16.26 U1.8
N$2
  Top 0.406: U1.7 41.47,16.03 X2.1
N$3
  pour Bottom (isolate 0.813): 0,0 80.01,0 80.01,67.06 0,67.06
N$4
  Top 0.406: X1.3 6.6,19.81 6.35,19.56 6.35,13.06 R3.1
N$5
  Top 1.93: Q1.D 18.54,35.31 16,37.85 12.95,37.85 D2.C
  Bottom 1.93: Q1.D 18.54,35.31 16,37.85 12.95,37.85 D2.C
  Bottom 3.81: JP20.1 4.32,37.59 12.7,37.59 D2.C
N$6  (via drill 0.6 pad 1.2)
  other vias: 4.06,62.99
N$7
  Top 0.406: R7.2 33.88,31.65 31.75,33.78 31.75,36.29 LED1.C
N$8
  Top 0.305: IC2.10 17.84,23.95 C5.1
N$9
  Top 0.406: X1.2 6.57,20.61 6.35,20.83 6.35,22.61 5.59,23.37 5.59,26.82 R2.1
N$10
  Top 0.406: LED4.C 33.02,40.89 33.78,40.13 33.78,35.05 34.54,34.29 45.47,34.29 46.23,33.53 R1.2
N$12
  Top 0.406: 70.48,32 69.85,31.5 69.6,31.24 | 71.12,32.38 70.74,31.75 | 71.12,32.38 71.88,32.38 71.12,32 | 70.87,31.5 70.87,31.24 | 71.12,30.99 70.87,31.5 | 70.87,31.5 70.74,31.75 | 70.74,31.75 71.12,32 | 71.12,32 70.87,31.5 | 71.12,32.38 69.6,31.24 | 69.6,31.24 70.74,32.13
N$13
  Top 0.406: 70.2,28.84 70.83,29.34 71.07,29.62 | 69.56,28.46 69.94,29.09 | 69.56,28.46 68.8,28.46 69.56,28.84 | 69.81,29.34 69.81,29.6 | 69.56,29.85 69.81,29.34 | 69.81,29.34 69.94,29.09 | 69.94,29.09 69.56,28.84 | 69.56,28.84 69.81,29.34 | 69.56,28.46 71.07,29.62 | 71.07,29.62 69.94,28.71
N$14
  Top 0.406: 70.1,28.96 70.36,29.21
N$15
  Top 0.406: 71.14,29.85 71.06,29.6
N$16
  Top 0.406: 71.14,29.85 71.09,29.98 71.15,29.88
N$17
  Top 0.406: LED2.C 32.77,38.61 33.02,38.35 33.02,33.78 33.78,33.02 43.94,33.02 44.2,32.77 R5.2
N$18
  Top 0.406: 69.67,29.82 69.82,29.02
N$19
  Top 0.406: 69.23,28.61 69.84,29.11
N$20
  Top 0.127: 70.23,28.71 70.07,28.65
N$21
  Top 0.127: 69.81,28.46 70.02,28.59
N$22
  Top 0.127: 70.22,28.7 69.76,28.44
N$23
  Top 0.127: 71.03,32.5 70.43,32.13
N$24
  Top 0.127: 71.18,31.81 71.32,31.96
N$25
  Top 0.127: 71.08,31.26 71.04,31.59
N$26
  Top 0.127: 71.19,31.22 71.26,31
N$27
  Top 0.127: 71.19,30.88 71.14,30.83
N$28
  Top 0.127: 69.37,29.93 69.37,31.04
N$29
  Top 0.127: 69.31,30.05 69.33,30.93
N$30
  Top 0.127: 69.26,30.22 69.28,30.8
N$31
  Top 0.127: 70.07,30.84 70.1,30.98
N$32
  Top 0.127: 70.06,30.97 70.31,31.08
N$33
  Top 0.127: 70.27,29.9 70.03,30.01
N$34
  Top 0.127: 70.06,30.16 70.1,29.92
N$35
  Top 0.127: 70.66,30.71 71.26,30.71
N$36
  Top 0.127: 70.7,30.26 71.22,30.26 71.03,29.6
N$37
  Top 0.127: 71.18,30.16 71.17,30.17
N$38
  Top 0.127: 70.7,30.26 70.57,30.02
N$39
  Top 0.127: 70.36,29.94 70.61,30.03
N$40
  Top 0.127: 70.62,30.14 70.5,29.96
N$41
  Top 0.127: 70.24,29.93 70.04,30.09
N$42
  Top 0.127: 70.01,30.32 70.13,29.97
N$43
  Top 0.127: 70.33,29.93 70.11,29.98
N$44
  Top 0.127: 70.08,30.84 70.29,31.03
N$45
  Top 0.127: 69.99,30.61 70.19,31.01
N$46
  Top 0.127: 70.07,30.92 70.46,31.09
N$47
  Top 0.127: 70.59,30.92 70.42,31.05
N$48
  Top 0.127: 70.65,30.71 70.64,30.9
N$49
  Top 0.127: 70.67,30.78 70.57,30.96
N$50
  Top 0.127: 71.27,30.71 71.27,31.03
N$51
  Top 0.127: 71.23,30.79 71.19,30.8
N$52
  Top 0.127: 71.29,30.27 71.29,29.9
N$53
  Top 0.127: 71.12,30.23 71.1,30.27
N$54
  Top 0.127: 71.1,30.24 71.14,30.23 71.25,30.26
N$55
  Top 0.127: 70.57,30.99 70.4,31.03
N$56
  Top 0.127: 70.69,30.26 arc-279 70.66,30.71
N$57
  Top 0.127: 70.09,30.19 70.49,30.01 70.16,30.07
N$58
  Top 0.127: 70.12,30.78 70.45,30.99 70.54,30.85 70.37,30.88
N$59  (via drill 0.6 pad 1.2)
  other vias: 4.06,4.06
N$60  (via drill 0.6 pad 1.2)
  other vias: 76.07,4.06
N$61  (via drill 0.6 pad 1.2)
  other vias: 76.07,62.99
N$62
  Top 2.54: 5.59,56.9 5.84,57.15
N$63
  Top 0.406: 55.12,13.59 56.64,13.59 | 56.64,13.59 56.39,13.34 56.39,13.84 56.64,13.59
N$64
  Top 0.406: R4.2 22.1,26.67 23.37,27.94 | 23.37,27.94 Q1.G 24.64,32.77 25.4,33.53 25.4,36.07 24.77,36.7 20.83,36.7 20.57,36.96 20.57,40.39 21.08,40.89 LED4.A | R11.2 23.37,27.94
RESET  (via drill 0.6 pad 1.2)
  Top 0.406: U1.29 32.26,13.58 32.26,11.43 30.87,10.04 R6.1 32.03,8.64 v32.26,8.64 | 67.56,4.19 JP7.1 67.56,5.08 60.71,11.94 v53.34,11.94 53.34,14.48 54.1,15.24 54.1,19.81 52.91,21 S1.3
  Bottom 0.406: v32.26,8.64 39.12,8.64 39.62,9.14 50.55,9.14 v53.34,11.94
V+  (via drill 0.6 pad 1.2, 0.6 pad 1.27, 0.6 pad 1.5)
  Top 0.406: v73.41,37.59 73.91,37.08 73.91,22.1 73.15,21.34 73.15,18.54 72.64,18.03 JP22.3 JP22.4 69.98,16.38 | LED2.A 29.46,38.61 29.72,38.86 29.72,41.66 28.96,42.42 10.92,42.42 8.26,39.75 | JP22.2 JP22.1
  Top 0.813: v51.31,54.86 51.31,50.86 C13.+ | C10.+ 30.92,54.29 v31.24,54.61
  Top 1.016: C12.+ 5.33,50.8 | C23.+ 78.23,44.45 78.36,44.58 78.36,51.94 78.49,52.07
  Top 1.778: v71.63,60.45 v51.56,60.45 | v51.56,60.45 v31.24,60.45 | v31.24,60.45 11.43,60.45 11.43,63.5 13.21,65.28 31.24,65.28 | 78.49,52.07 v78.49,53.34 v78.49,54.86 v78.49,56.39 78.49,57.4 77.47,58.42 72.64,58.42 71.63,59.18 v71.63,60.45 | 51.56,65.28 68.83,65.28 v69.85,64.26 v71.37,62.74 71.63,62.48 v71.63,60.45 | 51.56,65.28 v51.56,60.45 | 51.56,65.28 31.24,65.28 | 31.24,65.28 v31.24,60.45 | v9.14,57.66 9.14,54.86 | 6.86,54.86 5.33,54.86 | 5.33,56.64 5.33,57.15
  Top 1.93: 5.33,57.15 8.64,60.45 11.43,60.45 | 10.67,54.86 9.14,54.86 6.86,54.86 | 5.33,56.39 5.33,56.64
  Top 2.54: 5.33,55.63 5.33,56.64
  Top 3.81: v8.38,33.02 8.38,39.62 8.26,39.75 5.33,42.67 5.33,50.8 5.33,54.86 5.33,55.63
  Bottom 0.406: JP22.1 JP22.2 JP22.3 JP22.4 | v73.41,37.59 73.41,40.13 75.95,42.67 JP21.1
  Bottom 0.813: P3.VMOT 51.56,55.12 v51.31,54.86 | v31.24,54.61 P2.VMOT
  Bottom 1.676: P2.VMOT v31.24,60.45 | P3.VMOT v51.56,60.45
  Bottom 1.778: v78.49,53.34 78.49,53.85 v78.49,54.86 v78.49,56.39 78.49,57.4 77.47,58.42 72.64,58.42 71.63,59.18 v71.63,60.45 71.63,62.48 v71.37,62.74 v69.85,64.26 | P1.VMOT v9.14,57.66
  Bottom 2.54: JP21.1 78.36,51.05 78.49,51.18 78.49,53.85
  Bottom 3.81: JP20.2 8.3,33.1 v8.38,33.02 D2.A
X-MOT-1A
  Bottom 1.016: JP10.3 P1.1A
X-MOT-1A1
  Bottom 1.016: JP2.3 P2.1A
X-MOT-1A2
  Bottom 1.016: JP16.3 P3.1A
X-MOT-1B
  Bottom 1.016: JP10.4 P1.1B
X-MOT-1B1
  Bottom 1.016: JP2.4 P2.1B
X-MOT-1B2
  Bottom 1.016: JP16.4 P3.1B
X-MOT-2A
  Bottom 1.016: JP10.2 P1.2A
X-MOT-2A1
  Bottom 1.016: JP2.2 P2.2A
X-MOT-2A2
  Bottom 1.016: P3.2A JP16.2
X-MOT-2B
  Bottom 1.016: JP10.1 P1.2B
X-MOT-2B1
  Bottom 1.016: P2.2B JP2.1
X-MOT-2B2
  Bottom 1.016: P3.2B JP16.1
X-MS1
  Top 0.406: R10.2 20.93,49.63 JP11.1
  Bottom 0.406: P1.MS1 16.51,48.01 20.32,48.01 21.08,48.77 JP11.1
X-MS2
  Bottom 0.406: P1.MS2 18.29,47.24 22.86,47.24 23.62,48.01 JP12.1
X-MS3
  Bottom 0.406: P1.MS3 20.07,46.48 25.4,46.48 26.16,47.24 JP13.1
X-MS4
  Bottom 0.406: P2.MS2 38.86,47.5 43.18,47.5 43.94,48.26 JP14.1
X-MS5
  Bottom 0.406: P2.MS3 40.64,46.74 45.47,46.74 46.48,47.75 JP15.1
X-MS6  (via drill 0.6 pad 1.2)
  Top 0.406: R8.2 30.58,31.34 v30.61,32
  Bottom 0.406: JP3.1 41.4,49.28 40.39,48.26 37.08,48.26 P2.MS1 33.78,42.42 30.73,39.37 30.73,32.13 v30.61,32
X-MS7
  Bottom 0.406: P3.MS2 58.93,47.24 62.99,47.24 64.26,48.51 JP18.1
X-MS8
  Bottom 0.406: P3.MS3 60.71,46.48 65.53,46.48 66.8,47.75 JP19.1
X-MS9  (via drill 0.6 pad 1.2)
  Top 0.406: R9.2 38.76,30.23 47.5,30.23 48.26,30.99 48.26,40.89 50.04,42.67 53.85,42.67 v54.1,42.93
  Bottom 0.406: JP17.1 61.72,49.02 60.71,48.01 57.15,48.01 P3.MS1 v54.1,42.93
X-RESETSLEEP
  Bottom 1.016: P1.!SLP P1.!RST
X-RESETSLEEP1
  Bottom 1.016: P2.!SLP P2.!RST
X-RESETSLEEP2
  Bottom 1.016: P3.!SLP P3.!RST
(copper drawn outside any net)
  shapes: Top circle x2

### Text on the board
Top: http://reprap.org/wiki/Cyclone_PCB_Factory | X | Y | Z | Spindle ON | 12V Power | Z | CYCLNE | 5V Power | Ver. 1.1 | GRBL | (c) 2013 | X | C | CNTRL | !RST! | Y | 12V | ISP | MOSI | MISO | SCK | !RST! | D11...13 | GND | 5V | A0 | A1 | A2 | A3 | A4 | A5 | A6 | A7 | D0 | D1 | D2 | D3 | D4 | D5 | D6 | D7 | D8 | D9 | D10 | D11 | D12 | D13 | RST
Bottom: http://reprap.org/wiki/Cyclone_PCB_Factory
Measures: 80x67mm